# Altium project BlinkBoard_micro.PrjPcb (part 1 of 2)
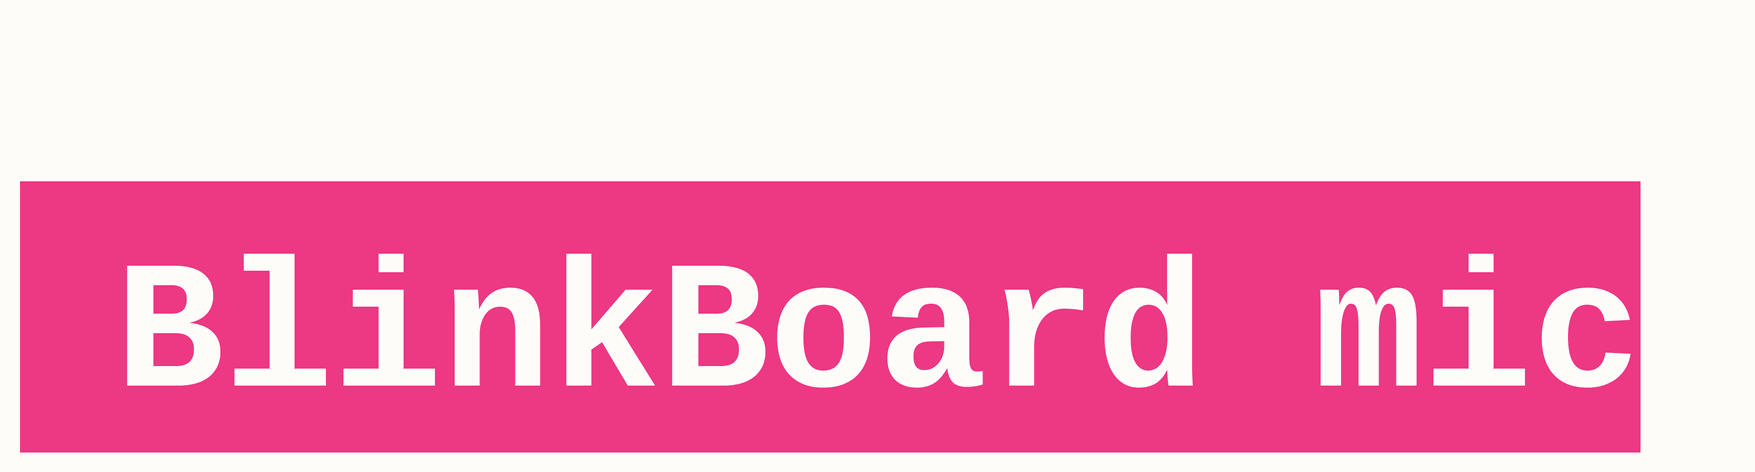
[diagram p0: Title.SchDoc]
3 sheets, 108 parts. Net scope: flat (ports and power ports of the same name join across sheets).
Board file: BlinkBoard_micro.PcbDoc
Sheets:
  Title.SchDoc
  BlinkBoard_micro_v1.SchDoc
  BlinkBoard_micro_v1_JACDAC.SchDoc

## Sheet Title.SchDoc
size A3; SheetNumber: 1; SheetTotal: 3

### Notes on the sheet
- BlinkBoard micro

## Sheet BlinkBoard_micro_v1.SchDoc: BlinkBoard
size A3; DrawnBy: Andrea; Revision: 0.1.0; SheetNumber: 2; SheetTotal: 3
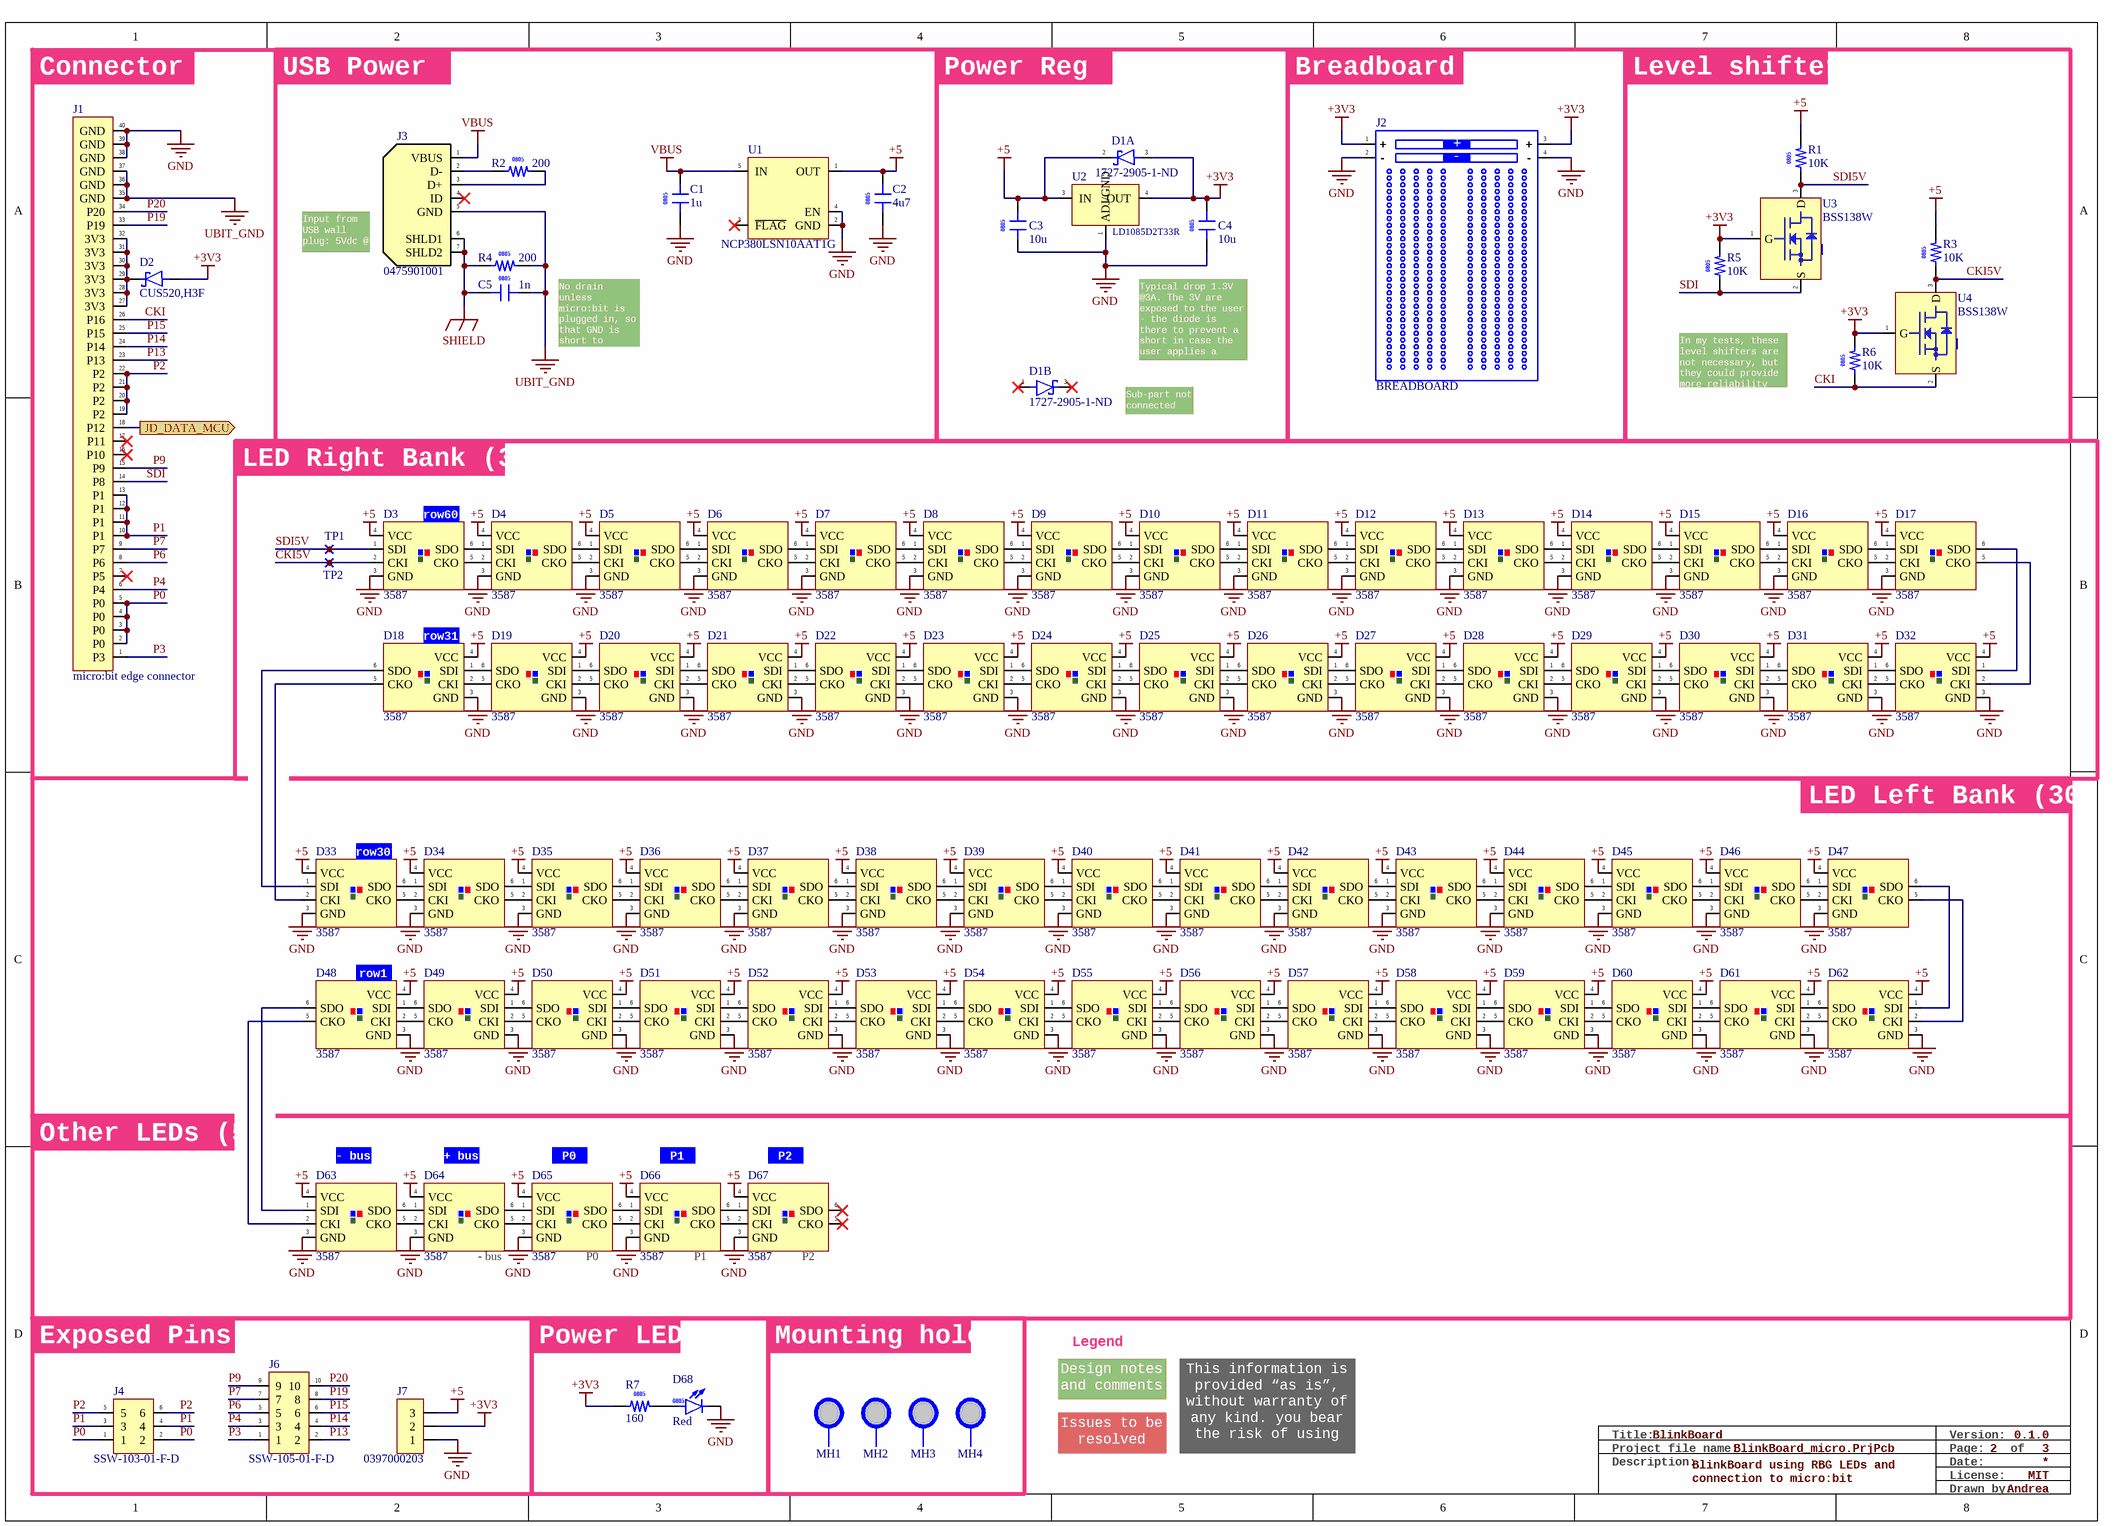
[diagram p1: BlinkBoard_micro_v1.SchDoc]

### Parts
C1  1u  [C0805]
C2  4u7  [C0805]
C3  10u  [C0805]
C4  10u  [C0805]
C5  1n  [C0805]
D1  1727-2905-1-ND  [SOT323]  (parts A,B of 2)
D2  CUS520,H3F  [FP-USC-MFG]
D3  3587  [APA102-2020]
D4  3587  [APA102-2020]
D5  3587  [APA102-2020]
D6  3587  [APA102-2020]
D7  3587  [APA102-2020]
D8  3587  [APA102-2020]
D9  3587  [APA102-2020]
D10  3587  [APA102-2020]
D11  3587  [APA102-2020]
D12  3587  [APA102-2020]
D13  3587  [APA102-2020]
D14  3587  [APA102-2020]
D15  3587  [APA102-2020]
D16  3587  [APA102-2020]
D17  3587  [APA102-2020]
D18  3587  [APA102-2020]
D19  3587  [APA102-2020]
D20  3587  [APA102-2020]
D21  3587  [APA102-2020]
D22  3587  [APA102-2020]
D23  3587  [APA102-2020]
D24  3587  [APA102-2020]
D25  3587  [APA102-2020]
D26  3587  [APA102-2020]
D27  3587  [APA102-2020]
D28  3587  [APA102-2020]
D29  3587  [APA102-2020]
D30  3587  [APA102-2020]
D31  3587  [APA102-2020]
D32  3587  [APA102-2020]
D33  3587  [APA102-2020]
D34  3587  [APA102-2020]
D35  3587  [APA102-2020]
D36  3587  [APA102-2020]
D37  3587  [APA102-2020]
D38  3587  [APA102-2020]
D39  3587  [APA102-2020]
D40  3587  [APA102-2020]
D41  3587  [APA102-2020]
D42  3587  [APA102-2020]
D43  3587  [APA102-2020]
D44  3587  [APA102-2020]
D45  3587  [APA102-2020]
D46  3587  [APA102-2020]
D47  3587  [APA102-2020]
D48  3587  [APA102-2020]
D49  3587  [APA102-2020]
D50  3587  [APA102-2020]
D51  3587  [APA102-2020]
D52  3587  [APA102-2020]
D53  3587  [APA102-2020]
D54  3587  [APA102-2020]
D55  3587  [APA102-2020]
D56  3587  [APA102-2020]
D57  3587  [APA102-2020]
D58  3587  [APA102-2020]
D59  3587  [APA102-2020]
D60  3587  [APA102-2020]
D61  3587  [APA102-2020]
D62  3587  [APA102-2020]
D63  3587  [APA102-2020]
D64  3587  [APA102-2020]
D65  3587  [APA102-2020]
D66  3587  [APA102-2020]
D67  3587  [APA102-2020]
D68  Red  [LED0805]
J1  micro:bit edge connector  [EDGE_CONNECTOR_40]
J2  BREADBOARD  [BREADBOARD]
J3  0475901001  [USB_MICRO]
J4  SSW-103-01-F-D  [HDR_6_2.54]
J6  SSW-105-01-F-D  [HDR_10_2.54]
J7  0397000203  [TERM_BLOCK_3POS]
MH1  MH 3.2mm NP  [MH3.2MM]  (value not drawn)  (no BOM)
MH2  MH 3.2mm NP  [MH3.2MM]  (value not drawn)  (no BOM)
MH3  MH 3.2mm NP  [MH3.2MM]  (value not drawn)  (no BOM)
MH4  MH 3.2mm NP  [MH3.2MM]  (value not drawn)  (no BOM)
R1  10K  [R0805]
R2  200  [R0805]
R3  10K  [R0805]
R4  200  [R0805]
R5  10K  [R0805]
R6  10K  [R0805]
R7  160  [R0805]
TP1  TEST  [TEST POINT]  (value not drawn)
TP2  TEST  [TEST POINT]  (value not drawn)
U1  NCP380LSN10AAT1G  [TSOP-5]
U2  LD1085D2T33R  [D2PAK]
U3  BSS138W  [SOT323]
U4  BSS138W  [SOT323]

### Blocks framed on the sheet
USB Power: C1 C2 C5 J3 R2 R4 U1
Power Reg: C3 C4 D1 U2
Breadboard: J2
Level shifters: R1 R3 R5 R6 U3 U4
LED Left Bank (30): D33-D62
Other LEDs (5): D63-D67
Exposed Pins: J4 J6 J7
Power LED: D68 R7
Mounting holes: MH1-MH4

### Ports
JD_DATA_MCU (out)

### Nets
+3V3: C4.2 D1.3 D2.2(A) J2.1(+) J2.3(+) J7.2 R5.2 R6.2 R7.1 U2.4(OUT) U3.1(G) U4.1(G)
+5: C2.2 C3.2 D1.2 D3.4(VCC) D4.4(VCC) D5.4(VCC) D6.4(VCC) D7.4(VCC) D8.4(VCC) D9.4(VCC) D10.4(VCC) D11.4(VCC) D12.4(VCC) D13.4(VCC) D14.4(VCC) D15.4(VCC) D16.4(VCC) D17.4(VCC) D18.4(VCC) D19.4(VCC) D20.4(VCC) D21.4(VCC) D22.4(VCC) D23.4(VCC) D24.4(VCC) D25.4(VCC) D26.4(VCC) D27.4(VCC) D28.4(VCC) D29.4(VCC) D30.4(VCC) D31.4(VCC) D32.4(VCC) D33.4(VCC) D34.4(VCC) D35.4(VCC) D36.4(VCC) D37.4(VCC) D38.4(VCC) D39.4(VCC) D40.4(VCC) D41.4(VCC) D42.4(VCC) D43.4(VCC) D44.4(VCC) D45.4(VCC) D46.4(VCC) D47.4(VCC) D48.4(VCC) D49.4(VCC) D50.4(VCC) D51.4(VCC) D52.4(VCC) D53.4(VCC) D54.4(VCC) D55.4(VCC) D56.4(VCC) D57.4(VCC) D58.4(VCC) D59.4(VCC) D60.4(VCC) D61.4(VCC) D62.4(VCC) D63.4(VCC) D64.4(VCC) D65.4(VCC) D66.4(VCC) D67.4(VCC) J7.3 R1.2 R3.2 U1.1(OUT) U2.3(IN)
GND: C1.1 C2.1 C3.1 C4.1 D3.3(GND) D4.3(GND) D5.3(GND) D6.3(GND) D7.3(GND) D8.3(GND) D9.3(GND) D10.3(GND) D11.3(GND) D12.3(GND) D13.3(GND) D14.3(GND) D15.3(GND) D16.3(GND) D17.3(GND) D18.3(GND) D19.3(GND) D20.3(GND) D21.3(GND) D22.3(GND) D23.3(GND) D24.3(GND) D25.3(GND) D26.3(GND) D27.3(GND) D28.3(GND) D29.3(GND) D30.3(GND) D31.3(GND) D32.3(GND) D33.3(GND) D34.3(GND) D35.3(GND) D36.3(GND) D37.3(GND) D38.3(GND) D39.3(GND) D40.3(GND) D41.3(GND) D42.3(GND) D43.3(GND) D44.3(GND) D45.3(GND) D46.3(GND) D47.3(GND) D48.3(GND) D49.3(GND) D50.3(GND) D51.3(GND) D52.3(GND) D53.3(GND) D54.3(GND) D55.3(GND) D56.3(GND) D57.3(GND) D58.3(GND) D59.3(GND) D60.3(GND) D61.3(GND) D62.3(GND) D63.3(GND) D64.3(GND) D65.3(GND) D66.3(GND) D67.3(GND) D68.1(C) J1.38(GND) J1.39(GND) J1.40(GND) J2.2(-) J2.4(-) J7.1 U1.2(GND) U1.4(EN) U2.1(ADJ/GND)
SHIELD: C5.1 J3.6(SHLD1) J3.7(SHLD2) R4.1
UBIT_GND: C5.2 J1.35(GND) J1.36(GND) J1.37(GND) J3.5(GND) R4.2
VBUS: C1.2 J3.1(VBUS) U1.5(IN)
CKI: J1.26(P16) R6.1 U4.2(S)
CKI5V: D3.2(CKI) R3.1 TP2.1 U4.3(D)
P0: J1.2(P0) J1.3(P0) J1.4(P0) J1.5(P0) J4.1 J4.2
P1: J1.10(P1) J1.11(P1) J1.12(P1) J1.13(P1) J4.3 J4.4
P2: J1.19(P2) J1.20(P2) J1.21(P2) J1.22(P2) J4.5 J4.6
P3: J1.1(P3) J6.1
P4: J1.6(P4) J6.3
P6: J1.8(P6) J6.5
P7: J1.9(P7) J6.7
P9: J1.15(P9) J6.9
P13: J1.23(P13) J6.2
P14: J1.24(P14) J6.4
P15: J1.25(P15) J6.6
P19: J1.33(P19) J6.8
P20: J1.34(P20) J6.10
SDI: J1.14(P8) R5.1 U3.2(S)
SDI5V: D3.1(SDI) R1.1 TP1.1 U3.3(D)
NetD2_1: D2.1(C) J1.27(3V3) J1.28(3V3) J1.29(3V3) J1.30(3V3) J1.31(3V3) J1.32(3V3)
NetD3_5: D3.5(CKO) D4.2(CKI)
NetD3_6: D3.6(SDO) D4.1(SDI)
NetD4_5: D4.5(CKO) D5.2(CKI)
NetD4_6: D4.6(SDO) D5.1(SDI)
NetD5_5: D5.5(CKO) D6.2(CKI)
NetD5_6: D5.6(SDO) D6.1(SDI)
NetD6_5: D6.5(CKO) D7.2(CKI)
NetD6_6: D6.6(SDO) D7.1(SDI)
NetD7_5: D7.5(CKO) D8.2(CKI)
NetD7_6: D7.6(SDO) D8.1(SDI)
NetD8_5: D8.5(CKO) D9.2(CKI)
NetD8_6: D8.6(SDO) D9.1(SDI)
NetD9_5: D9.5(CKO) D10.2(CKI)
NetD9_6: D9.6(SDO) D10.1(SDI)
NetD10_5: D10.5(CKO) D11.2(CKI)
NetD10_6: D10.6(SDO) D11.1(SDI)
NetD11_5: D11.5(CKO) D12.2(CKI)
NetD11_6: D11.6(SDO) D12.1(SDI)
NetD12_5: D12.5(CKO) D13.2(CKI)
NetD12_6: D12.6(SDO) D13.1(SDI)
NetD13_5: D13.5(CKO) D14.2(CKI)
NetD13_6: D13.6(SDO) D14.1(SDI)
NetD14_5: D14.5(CKO) D15.2(CKI)
NetD14_6: D14.6(SDO) D15.1(SDI)
NetD15_5: D15.5(CKO) D16.2(CKI)
NetD15_6: D15.6(SDO) D16.1(SDI)
NetD16_5: D16.5(CKO) D17.2(CKI)
NetD16_6: D16.6(SDO) D17.1(SDI)
NetD17_5: D17.5(CKO) D32.2(CKI)
NetD17_6: D17.6(SDO) D32.1(SDI)
NetD18_1: D18.1(SDI) D19.6(SDO)
NetD18_2: D18.2(CKI) D19.5(CKO)
NetD18_5: D18.5(CKO) D33.2(CKI)
NetD18_6: D18.6(SDO) D33.1(SDI)
NetD19_1: D19.1(SDI) D20.6(SDO)
NetD19_2: D19.2(CKI) D20.5(CKO)
NetD20_1: D20.1(SDI) D21.6(SDO)
NetD20_2: D20.2(CKI) D21.5(CKO)
NetD21_1: D21.1(SDI) D22.6(SDO)
NetD21_2: D21.2(CKI) D22.5(CKO)
NetD22_1: D22.1(SDI) D23.6(SDO)
NetD22_2: D22.2(CKI) D23.5(CKO)
NetD23_1: D23.1(SDI) D24.6(SDO)
NetD23_2: D23.2(CKI) D24.5(CKO)
NetD24_1: D24.1(SDI) D25.6(SDO)
NetD24_2: D24.2(CKI) D25.5(CKO)
NetD25_1: D25.1(SDI) D26.6(SDO)
NetD25_2: D25.2(CKI) D26.5(CKO)
NetD26_1: D26.1(SDI) D27.6(SDO)
NetD26_2: D26.2(CKI) D27.5(CKO)
NetD27_1: D27.1(SDI) D28.6(SDO)
NetD27_2: D27.2(CKI) D28.5(CKO)
NetD28_1: D28.1(SDI) D29.6(SDO)
NetD28_2: D28.2(CKI) D29.5(CKO)
NetD29_1: D29.1(SDI) D30.6(SDO)
NetD29_2: D29.2(CKI) D30.5(CKO)
NetD30_1: D30.1(SDI) D31.6(SDO)
NetD30_2: D30.2(CKI) D31.5(CKO)
NetD31_1: D31.1(SDI) D32.6(SDO)
NetD31_2: D31.2(CKI) D32.5(CKO)
NetD33_5: D33.5(CKO) D34.2(CKI)
NetD33_6: D33.6(SDO) D34.1(SDI)
NetD34_5: D34.5(CKO) D35.2(CKI)
NetD34_6: D34.6(SDO) D35.1(SDI)
NetD35_5: D35.5(CKO) D36.2(CKI)
NetD35_6: D35.6(SDO) D36.1(SDI)
NetD36_5: D36.5(CKO) D37.2(CKI)
NetD36_6: D36.6(SDO) D37.1(SDI)
NetD37_5: D37.5(CKO) D38.2(CKI)
NetD37_6: D37.6(SDO) D38.1(SDI)
NetD38_5: D38.5(CKO) D39.2(CKI)
NetD38_6: D38.6(SDO) D39.1(SDI)
NetD39_5: D39.5(CKO) D40.2(CKI)
NetD39_6: D39.6(SDO) D40.1(SDI)
NetD40_5: D40.5(CKO) D41.2(CKI)
NetD40_6: D40.6(SDO) D41.1(SDI)
NetD41_5: D41.5(CKO) D42.2(CKI)
NetD41_6: D41.6(SDO) D42.1(SDI)
NetD42_5: D42.5(CKO) D43.2(CKI)
NetD42_6: D42.6(SDO) D43.1(SDI)
NetD43_5: D43.5(CKO) D44.2(CKI)
NetD43_6: D43.6(SDO) D44.1(SDI)
NetD44_5: D44.5(CKO) D45.2(CKI)
NetD44_6: D44.6(SDO) D45.1(SDI)
NetD45_5: D45.5(CKO) D46.2(CKI)
NetD45_6: D45.6(SDO) D46.1(SDI)
NetD46_5: D46.5(CKO) D47.2(CKI)
NetD46_6: D46.6(SDO) D47.1(SDI)
NetD47_5: D47.5(CKO) D62.2(CKI)
NetD47_6: D47.6(SDO) D62.1(SDI)
NetD48_1: D48.1(SDI) D49.6(SDO)
NetD48_2: D48.2(CKI) D49.5(CKO)
NetD48_5: D48.5(CKO) D63.2(CKI)
NetD48_6: D48.6(SDO) D63.1(SDI)
NetD49_1: D49.1(SDI) D50.6(SDO)
NetD49_2: D49.2(CKI) D50.5(CKO)
NetD50_1: D50.1(SDI) D51.6(SDO)
NetD50_2: D50.2(CKI) D51.5(CKO)
NetD51_1: D51.1(SDI) D52.6(SDO)
NetD51_2: D51.2(CKI) D52.5(CKO)
NetD52_1: D52.1(SDI) D53.6(SDO)
NetD52_2: D52.2(CKI) D53.5(CKO)
NetD53_1: D53.1(SDI) D54.6(SDO)
NetD53_2: D53.2(CKI) D54.5(CKO)
NetD54_1: D54.1(SDI) D55.6(SDO)
NetD54_2: D54.2(CKI) D55.5(CKO)
NetD55_1: D55.1(SDI) D56.6(SDO)
NetD55_2: D55.2(CKI) D56.5(CKO)
NetD56_1: D56.1(SDI) D57.6(SDO)
NetD56_2: D56.2(CKI) D57.5(CKO)
NetD57_1: D57.1(SDI) D58.6(SDO)
NetD57_2: D57.2(CKI) D58.5(CKO)
NetD58_1: D58.1(SDI) D59.6(SDO)
NetD58_2: D58.2(CKI) D59.5(CKO)
NetD59_1: D59.1(SDI) D60.6(SDO)
NetD59_2: D59.2(CKI) D60.5(CKO)
NetD60_1: D60.1(SDI) D61.6(SDO)
NetD60_2: D60.2(CKI) D61.5(CKO)
NetD61_1: D61.1(SDI) D62.6(SDO)
NetD61_2: D61.2(CKI) D62.5(CKO)
NetD63_5: D63.5(CKO) D64.2(CKI)
NetD63_6: D63.6(SDO) D64.1(SDI)
NetD64_5: D64.5(CKO) D65.2(CKI)
NetD64_6: D64.6(SDO) D65.1(SDI)
NetD65_5: D65.5(CKO) D66.2(CKI)
NetD65_6: D65.6(SDO) D66.1(SDI)
NetD66_5: D66.5(CKO) D67.2(CKI)
NetD66_6: D66.6(SDO) D67.1(SDI)
NetD68_2: D68.2(A) R7.2
NetD72_3: J1.18(P12) ; port JD_DATA_MCU
NetJ3_2: J3.2(D-) R2.1
NetJ3_3: J3.3(D+) R2.2

Not connected (* = marked no-connect by the designer): D1 1*; D67 5(CKO)* 6(SDO)*; J1 7(P5)* 16(P10)* 17(P11)*; J3 4(ID)*; U1 3(~{FLAG})*

### Notes on the sheet
- (near J1) Connector
- Input from USB wall plug: 5Vdc @ 2.1A
- No drain unless micro:bit is plugged in, so that GND is short to UBIT_GND
- Typical drop 1.3V @3A. The 3V are exposed to the user - the diode is there to prevent a short in case the user applies a voltage higher than 3V.
- In my tests, these level shifters are not necessary, but they could provide more reliability
- LED Right Bank (30)
- Sub-part not connected
- (near D3) row60
- (near D18) row31
- (near D33) row30
- (near D48) row1
- (near D63) - bus
- (near D64) + bus
- (near D65) P0
- (near D66) P1
- (near D67) P2
- (near D64) - bus
- Legend
- Design notes and comments
- Issues to be resolved
- This information is provided “as is”, without warranty of any kind. you bear the risk of using it.
- Title:
- Description:
- Project file name:
- Drawn by:
- License:
- Page:
- Version:
- Date:
- of
- MIT
- BlinkBoard using RBG LEDs and connection to micro:bit
- (in symbol C0805_10u) 0805

### Library data of the parts
C1 = C0805_1u: Surface Mount Ceramic Multilayer Capacitor 1uF -20% to 80% Y5V 25V 0805 Paper T/R; Manufacturer: Yageo; Manufacturer Part Number: CC0805ZRY5V8BB105; Supplier 1: Digi-Key; RoHS: Yes; Category: Ceramic Capacitors; Stock 1: 285953; Mount: Surface Mount; Case/Package: 0805; Case Code (Metric): 2012; Case Code (Imperial): 0805; Weight: 0.000194oz; Min Operating Temperature: -30°C; Max Operating Temperature: 85°C; Capacitance: 1uF; Tolerance: 80%; Dielectric: Y5V; Package Quantity: 1; Voltage Rating: 25V; Packaging: Tape and Reel; Voltage Rating (DC): 25V; Termination: SMD/SMT; Resistor Type: Ceramic; Series: CC; Length: 2mm; Width: 0.049inch; Height: 0.85mm; Depth: 1.25mm; Thickness: 0.033inch; Radiation Hardening: No; RoHS Compliant: Yes; REACH SVHC: No SVHC; Lead Free: Lead Free; Halogen Free: Halogen Free; ComponentLink1URL: https://datasheet.ciiva.com/144/mlccorderingcode-144703.pdf?src-supplier=Digi-Key; ComponentLink1Description: https://datasheet.ciiva.com/144/mlccorderingcode-144703.pdf?src-supplier=Digi-Key; ComponentLink2URL: https://datasheet.ciiva.com/26863/getdatasheetpartid-419810-26863011.pdf?src-supplier=Verical; ComponentLink2Description: https://datasheet.ciiva.com/26863/getdatasheetpartid-419810-26863011.pdf?src-supplier=Verical; ComponentLink3URL: https://datasheet.ciiva.com/144/mlccorderingcode-144704.pdf?src-supplier=Digi-Key; ComponentLink3Description: https://datasheet.ciiva.com/144/mlccorderingcode-144704.pdf?src-supplier=Digi-Key; ComponentLink4URL: https://datasheet.ciiva.com/144/mlccorderingcode-144705.pdf?src-supplier=Digi-Key; ComponentLink4Description: https://datasheet.ciiva.com/144/mlccorderingcode-144705.pdf?src-supplier=Digi-Key; ComponentLink5URL: https://datasheet.ciiva.com/13208/upy-gp-np0-16v-to-50v-8-13208251.pdf?src-supplier=Mouser; ComponentLink5Description: https://datasheet.ciiva.com/13208/upy-gp-np0-16v-to-50v-8-13208251.pdf?src-supplier=Mouser; ComponentLink6URL: https://datasheet.ciiva.com/28450/1132289-28450860.pdf?src-supplier=Element14; ComponentLink6Description: https://datasheet.ciiva.com/28450/1132289-28450860.pdf?src-supplier=Element14; Supplier Part Number 1: 311-1358-1-ND; Pricing 1: 1=0.14000, 10=0.10200, 50=0.05820, 100=0.04820, 500=0.03378, 1000=0.02796 (USD)
C2 = C0805_4u7: Multilayer Ceramic Capacitors MLCC - SMD/SMT 4.7uF 6.3V X5R 10%; Manufacturer: Yageo; Manufacturer Part Number: CC0805KRX5R5BB475; Supplier 1: Digi-Key; RoHS: Yes; Category: Ceramic Capacitors; Stock 1: 19993; Mount: Surface Mount; Case/Package: 0805; Number of Pins: 2; Case Code (Imperial): 0805; Case Code (Metric): 2012; Weight: 0.000194oz; Min Operating Temperature: -55°C; Max Operating Temperature: 85°C; Capacitance: 4.7uF; Tolerance: 10%; Packaging: Tape and Reel; Voltage Rating (DC): 6.3V; Voltage Rating: 6.3V; Dielectric: X5R; Termination: SMD/SMT; Resistor Type: Ceramic; Series: CC; Length: 0.079inch; Width: 0.049inch; Thickness: 0.057inch; Lead Free: Lead Free; Halogen Free: Halogen Free; RoHS Compliant: Yes; ComponentLink1URL: http://www.mouser.com/ds/2/447/UPY-GPHC_X5R_4V-to-50V_25-1131599.pdf?src-supplier=Mouser; ComponentLink1Description: http://www.mouser.com/ds/2/447/UPY-GPHC_X5R_4V-to-50V_25-1131599.pdf?src-supplier=Mouser; ComponentLink2URL: http://components.arrow.com/part/dataview/0323_04166591?src-supplier=Arrow+Europe; ComponentLink2Description: http://components.arrow.com/part/dataview/0323_04166591?src-supplier=Arrow+Europe; ComponentLink3URL: http://www.yageo.com/documents/recent/UPY-GPHC_X5R_4V-to-50V_25.pdf?src-supplier=Digi-Key; ComponentLink3Description: http://www.yageo.com/documents/recent/UPY-GPHC_X5R_4V-to-50V_25.pdf?src-supplier=Digi-Key; ComponentLink4URL: http://www.yageo.com/documents/recent/UPY-GPHC_X5R_4V-to-50V_23.pdf?src-supplier=Digi-Key; ComponentLink4Description: http://www.yageo.com/documents/recent/UPY-GPHC_X5R_4V-to-50V_23.pdf?src-supplier=Digi-Key; Supplier Part Number 1: 311-3422-1-ND; Pricing 1: 1=0.17000, 10=0.12300, 50=0.07000, 100=0.05800, 500=0.04066, 1000=0.03365 (USD)
C3 C4 = C0805_10u: Cap Ceramic 10uF 10Vdc X5R 10% SMD 0805 85°C Paper T/R; Manufacturer: Yageo; Manufacturer Part Number: CC0805KPX5R6BB106; Supplier 1: Digi-Key; Stock 1: 54858; RoHS Compliant: Yes; ComponentLink1URL: http://datasheet.octopart.com/CC0805KPX5R6BB106-Yageo-datasheet-86397281.pdf; ComponentLink1Description: http://datasheet.octopart.com/CC0805KPX5R6BB106-Yageo-datasheet-86397281.pdf; Supplier Part Number 1: 13-CC0805KPX5R6BB106CT-ND; Pricing 1: 1=0.21000, 10=0.14300, 50=0.08560, 100=0.07240, 500=0.04952, 1000=0.04380, 2500=0.04190, 5000=0.03809 (USD)
C5 = C0805_1n: Surface Mount Ceramic Multilayer Capacitor 0.001uF 10% X7R 50V 0805 Paper T/R; Manufacturer: Yageo; Manufacturer Part Number: CC0805KRX7R9BB102; Capacitance: 1nF; Insulation Resistance: 100GR; Supplier 1: Digi-Key; RoHS: Yes; Category: Ceramic Capacitors; Stock 1: 240921; Mount: Surface Mount; Case/Package: 0805; Number of Pins: 2; Case Code (Metric): 2012; Case Code (Imperial): 0805; Material: Ceramic; Dielectric Material: Ceramic; Min Operating Temperature: -55°C; Max Operating Temperature: 125°C; Tolerance: 10%; Dielectric: X7R; Voltage Rating: 50V; Packaging: Tape and Reel; Voltage Rating (DC): 50V; Package Quantity: 1; Termination: SMD/SMT; Voltage: 50V; Series: CC; Length: 2mm; Width: 0.049inch; Height: 0.6mm; Depth: 1.25mm; Thickness: 0.024inch; Radiation Hardening: No; REACH SVHC: No SVHC; Lead Free: Lead Free; Halogen Free: Halogen Free; RoHS Compliant: Yes; ComponentLink1URL: https://datasheet.ciiva.com/11786/0900766b80d84f1d-11786074.pdf?src-supplier=RSComponents; ComponentLink1Description: https://datasheet.ciiva.com/11786/0900766b80d84f1d-11786074.pdf?src-supplier=RSComponents; ComponentLink2URL: https://datasheet.ciiva.com/144/mlccorderingcode-144616.pdf?src-supplier=Digi-Key; ComponentLink2Description: https://datasheet.ciiva.com/144/mlccorderingcode-144616.pdf?src-supplier=Digi-Key; ComponentLink3URL: https://datasheet.ciiva.com/144/mlccorderingcode-144617.pdf?src-supplier=Digi-Key; ComponentLink3Description: https://datasheet.ciiva.com/144/mlccorderingcode-144617.pdf?src-supplier=Digi-Key; ComponentLink4URL: https://datasheet.ciiva.com/144/mlccorderingcode-144618.pdf?src-supplier=Digi-Key; ComponentLink4Description: https://datasheet.ciiva.com/144/mlccorderingcode-144618.pdf?src-supplier=Digi-Key; ComponentLink5URL: https://datasheet.ciiva.com/16625/upy-gphc-x7r-6-3v-to-50v-8-16625547.pdf?src-supplier=Avnet+Europe; ComponentLink5Description: https://datasheet.ciiva.com/16625/upy-gphc-x7r-6-3v-to-50v-8-16625547.pdf?src-supplier=Avnet+Europe; ComponentLink6URL: https://datasheet.ciiva.com/46393/1489800-46393302.pdf?src-supplier=Element14; ComponentLink6Description: https://datasheet.ciiva.com/46393/1489800-46393302.pdf?src-supplier=Element14; ComponentLink7URL: https://datasheet.ciiva.com/28450/1489800-28450797.pdf?src-supplier=Element14; ComponentLink7Description: https://datasheet.ciiva.com/28450/1489800-28450797.pdf?src-supplier=Element14; Supplier Part Number 1: 311-1127-1-ND; Pricing 1: 1=0.10000, 10=0.07000, 50=0.03800, 100=0.03100, 500=0.02214, 1000=0.01739 (USD)
D1 = BAT54SW: Rectifier Diode Schottky 0.2A 5ns Automotive 3-Pin SC-70 T/R; Manufacturer: Nexperia; Manufacturer Part Number: BAT54SW,115; Supplier 1: Digi-Key; RoHS: Yes; Category: Rectifier Diodes; Stock 1: 166801; ComponentLink1URL: http://www.farnell.com/datasheets/1679676.pdf?src-supplier=Farnell; ComponentLink1Description: http://www.farnell.com/datasheets/1679676.pdf?src-supplier=Farnell; ComponentLink2URL: https://assets.nexperia.com/documents/data-sheet/BAT54W_SER.pdf?src-supplier=Digi-Key; ComponentLink2Description: https://assets.nexperia.com/documents/data-sheet/BAT54W_SER.pdf?src-supplier=Digi-Key; Supplier Part Number 1: 1727-2905-1-ND; Pricing 1: 1=0.23000, 10=0.20900, 100=0.11400, 500=0.07018, 1000=0.04785 (USD)
D2 = SCHOTTKY_0.2A: Diode Small Signal Schottky Si 0.2A 2-Pin USC T/R; Manufacturer: Toshiba; Average Rectified Current: 200mA; Max Repetitive Reverse Voltage (Vrrm): 30V; Element Configuration: Single; Max Reverse Current: 5uA; Peak Non-Repetitive Surge Current: 1A; Supplier 1: Digi-Key; Manufacturer Part Number: CUS520,H3F; RoHS: No; Category: Rectifier Diodes; Stock 1: 16652; Mount: Surface Mount; Number of Pins: 2; Contact Plating: Tin,Silver; Min Operating Temperature: -40°C; Max Operating Temperature: 100°C; Packaging: Tape and Reel; Max Reverse Voltage (DC): 30V; RoHS Compliant: No; ComponentLink1URL: https://toshiba.semicon-storage.com/info/docget.jsp?did=7041&prodName=CUS520&src-supplier=Digi-Key; ComponentLink1Description: https://toshiba.semicon-storage.com/info/docget.jsp?did=7041&prodName=CUS520&src-supplier=Digi-Key; ComponentLink2URL: http://toshiba.semicon-storage.com/info/docget.jsp?did=7041&prodName=CUS520&src-supplier=Avnet; ComponentLink2Description: http://toshiba.semicon-storage.com/info/docget.jsp?did=7041&prodName=CUS520&src-supplier=Avnet; ComponentLink3URL: http://toshiba.semicon-storage.com/info/lookup.jsp?pid=CUS520&amp;lang=en&src-supplier=Mouser; ComponentLink3Description: http://toshiba.semicon-storage.com/info/lookup.jsp?pid=CUS520&amp;lang=en&src-supplier=Mouser; Supplier Part Number 1: CUS520H3FCT-ND; Pricing 1: 1=0.22000, 10=0.17700, 100=0.09400, 500=0.06188, 1000=0.04208 (USD)
D3-D67 = DOT_STAR_LED: DotStar Micro LEDs (APA102–2020)- Smart SMD RGB LED - 100 pack; Manufacturer: Adafruit Industries; Color: Blue,Green,Red; Interface: Serial; Number of LEDs: 100; Supplier 1: Digi-Key; Manufacturer Part Number: 3587; RoHS: No; Stock 1: 113; Mount: Surface Mount; Length: 2mm; Width: 2mm; ComponentLink1URL: https://media.digikey.com/pdf/Data%20Sheets/Adafruit%20PDFs/3587_Web.pdf?src-supplier=Digi-Key; ComponentLink1Description: https://media.digikey.com/pdf/Data%20Sheets/Adafruit%20PDFs/3587_Web.pdf?src-supplier=Digi-Key; Supplier Part Number 1: 1528-2392-ND; Pricing 1: 1=29.95000 (USD)
D68 = LED0805: SMD LED red 2.4 V 0805, 150080RS75000, Würth Elektronik; Manufacturer: Wurth Electronics; Luminous Intensity: 150mcd; Viewing Angle: 140°; Forward Voltage: 2V; Wavelength: 625nm; Lens Style: Clear,Rectangular; Forward Current: 30mA; Test Current: 20mA; Supplier 1: Digi-Key; Manufacturer Part Number: 150080RS75000; RoHS: Yes; Category: LEDs; Stock 1: 53458; Mount: Surface Mount; Case/Package: 0805; Color: Red; Case Code (Metric): 2012; Case Code (Imperial): 0805; Min Operating Temperature: -40°C; Max Operating Temperature: 85°C; Package Quantity: 4000; Packaging: Tape and Reel; Dominant Wavelength: 625nm; Length: 2mm; Width: 1.25mm; Height: 0.7mm; REACH SVHC: Unknown; RoHS Compliant: Yes; ComponentLink1URL: https://datasheet.ciiva.com/22656/150080rs75000-22656961.pdf?src-supplier=Element14; ComponentLink1Description: https://datasheet.ciiva.com/22656/150080rs75000-22656961.pdf?src-supplier=Element14; ComponentLink2URL: https://datasheet.ciiva.com/29279/759435-da-01-en-chipled-0805-w-kl-rot-150080rs75000-29279032.pdf?src-supplier=Conrad; ComponentLink2Description: https://datasheet.ciiva.com/29279/759435-da-01-en-chipled-0805-w-kl-rot-150080rs75000-29279032.pdf?src-supplier=Conrad; Supplier Part Number 1: 732-4984-6-ND; Pricing 1: 1=0.18000, 50=0.16500, 100=0.14200, 500=0.12300 (USD)
J1 = EDGE_CONNECTOR_40: 3887 - SMT Right-Angle Connector for micro:bit; Manufacturer: Adafruit Industries; Manufacturer Part Number: 3887; Supplier 1: Digi-Key; RoHS: No; Stock 1: 1; Supplier Part Number 1: 1528-2644-ND; Pricing 1: 1=2.95000 (USD); ComponentLink1Description: Drawings; ComponentLink1URL: https://cdn-shop.adafruit.com/product-files/3887/3887_datasheet.pdf
J2 = BREADBOARD_60: Breadboard with 2 columns of 30 rows + VCC and GND rails
J3 = USB_MICRO: USB - micro AB  Receptacle Connector 5 Position Surface Mount, Right Angle, Horizontal; Manufacturer: Molex; Number of Terminals/Pins: 5; Number of Ports: 1; Max Voltage Rating (AC): 30V; Pitch: 0.65mm; Supplier 1: Digi-Key; Manufacturer Part Number: 0475901001; RoHS: Yes; Category: USB Connectors; Stock 1: 6607; Mount: Surface Mount,Horizontal; Contact Material: Copper Alloy; Housing Material: Thermoplastic; Min Operating Temperature: -30°C; Max Operating Temperature: 85°C; Packaging: Tape and Reel; Package Quantity: 1500; Connector Type: USB; Number of Contacts: 5; Gender: Receptacle; Termination: Solder; Orientation: Right Angle; Features: Shielded; Length: 8.65mm; Depth: 6.1mm; Radiation Hardening: No; RoHS Compliant: Yes; ComponentLink1URL: https://datasheet.ciiva.com/29660/475901001-sd-29660111.pdf?src-supplier=Digi-Key; ComponentLink1Description: https://datasheet.ciiva.com/29660/475901001-sd-29660111.pdf?src-supplier=Digi-Key; Supplier Part Number 1: WM14336CT-ND; Pricing 1: 1=0.97000, 10=0.79900, 100=0.66600 (USD)
J4 = HDR_6_2.54: SAMTEC - SSW-103-01-F-D - CONNECTOR, RECEPTACLE, 6 CONTACTS, 2 ROWS, 2.54 MM; Max Current Rating: 7.6A; Contact Resistance: 10mR; Max Voltage Rating (AC): 550V; Number of Contacts: 6; Gender: Female; Mating Cycles: 100; Pitch: 2.54mm; Supplier 1: Digi-Key; Manufacturer: Samtec; Manufacturer Part Number: SSW-103-01-F-D; RoHS: Yes; Category: Headers and Wire Housings; Stock 1: 1509; Contact Plating: Gold; Contact Material: Bronze; Housing Color: Black; Color: Black; Housing Material: Polymer; Min Operating Temperature: -55°C; Max Operating Temperature: 125°C; Number of Rows: 2; Packaging: Bulk; Termination: Solder; Orientation: Vertical; Length: 8.13mm; Depth: 4.95mm; Radiation Hardening: No; RoHS Compliant: Yes; ComponentLink1URL: http://www.farnell.com/datasheets/2550265.pdf?src-supplier=Farnell; ComponentLink1Description: http://www.farnell.com/datasheets/2550265.pdf?src-supplier=Farnell; ComponentLink2URL: http://components.arrow.com/part/dataview/4842126S6546715N1004?src-supplier=Arrow+Electronics; ComponentLink2Description: http://components.arrow.com/part/dataview/4842126S6546715N1004?src-supplier=Arrow+Electronics; ComponentLink3URL: http://components.arrow.com/part/dataview/0323_00788229?src-supplier=Arrow+Europe; ComponentLink3Description: http://components.arrow.com/part/dataview/0323_00788229?src-supplier=Arrow+Europe; ComponentLink4URL: ftp://ftp.samtec.com/webfiles/PDF/SSQ_TH.PDF?src-supplier=Avnet; ComponentLink4Description: ftp://ftp.samtec.com/webfiles/PDF/SSQ_TH.PDF?src-supplier=Avnet; ComponentLink5URL: http://suddendocs.samtec.com/catalog_english/ssw_th.pdf?src-supplier=Digi-Key; ComponentLink5Description: http://suddendocs.samtec.com/catalog_english/ssw_th.pdf?src-supplier=Digi-Key; ComponentLink6URL: ftp://ftp.samtec.com/webfiles/PDF/SSQ_TH.PDF?src-supplier=Avnet+Europe; ComponentLink6Description: ftp://ftp.samtec.com/webfiles/PDF/SSQ_TH.PDF?src-supplier=Avnet+Europe; ComponentLink7URL: http://www.farnell.com/datasheets/2550265.pdf?src-supplier=Newark; ComponentLink7Description: http://www.farnell.com/datasheets/2550265.pdf?src-supplier=Newark; Supplier Part Number 1: SAM10016-ND; Pricing 1: 1=1.42000, 10=1.28700, 100=1.10290, 500=0.91910, 1000=0.78780, 5000=0.69852, 10000=0.68276 (USD)
J6 = HDR_10_2.54: Conn Socket Strip SKT 10 POS 2.54mm Solder ST Thru-Hole; Manufacturer: Samtec; Max Current Rating: 6.9A; Contact Resistance: 10mR; Max Voltage Rating (AC): 550V; Number of Contacts: 10; Gender: Female; Mating Cycles: 100; Supplier 1: Digi-Key; Manufacturer Part Number: SSW-105-01-F-D; RoHS: Yes; Category: Headers and Wire Housings; Stock 1: 1336; Contact Plating: Gold; Contact Material: Bronze; Housing Color: Black; Color: Black; Housing Material: Polymer; Min Operating Temperature: -55°C; Max Operating Temperature: 125°C; Number of Rows: 2; Packaging: Bulk; Termination: Solder; Orientation: Straight; Length: 13.21mm; Pitch: 2.54mm; Depth: 4.95mm; Radiation Hardening: No; ComponentLink1URL: http://components.arrow.com/part/dataview/2696898S8147588N1004?src-supplier=Arrow+Electronics; ComponentLink1Description: http://components.arrow.com/part/dataview/2696898S8147588N1004?src-supplier=Arrow+Electronics; ComponentLink2URL: http://components.arrow.com/part/dataview/0323_01330192?src-supplier=Arrow+Europe; ComponentLink2Description: http://components.arrow.com/part/dataview/0323_01330192?src-supplier=Arrow+Europe; ComponentLink3URL: http://suddendocs.samtec.com/catalog_english/ssw_th.pdf?src-supplier=Digi-Key; ComponentLink3Description: http://suddendocs.samtec.com/catalog_english/ssw_th.pdf?src-supplier=Digi-Key; ComponentLink4URL: ftp://ftp.samtec.com/webfiles/PDF/SSQ_TH.PDF?src-supplier=Avnet; ComponentLink4Description: ftp://ftp.samtec.com/webfiles/PDF/SSQ_TH.PDF?src-supplier=Avnet; ComponentLink5URL: ftp://ftp.samtec.com/webfiles/PDF/SSQ_TH.PDF?src-supplier=Avnet+Europe; ComponentLink5Description: ftp://ftp.samtec.com/webfiles/PDF/SSQ_TH.PDF?src-supplier=Avnet+Europe; Supplier Part Number 1: SAM9143-ND; Pricing 1: 1=1.87000, 10=1.62900, 100=1.45530, 500=1.21276, 1000=1.03950, 5000=0.92400 (USD)
J7 = TERM_BLOCK_3POS: SPRING TERMINAL BLOCK 3CVERT GRE; Manufacturer: Molex; Plating: Steel; Number of Levels: 1; Number of Positions Per Level: 3; Current: 6A; Voltage: 150V; Pitch: 0.1inch; Wire Gauge (Max): 26AWG; Wire Gauge (Min): 18AWG; Supplier 1: Digi-Key; Manufacturer Part Number: 0397000203; RoHS: Yes; Category: Terminal Blocks; Stock 1: 1368; Mount: Through Hole; Color: Green; Contact Plating: Brass,Tin; Housing Material: Nylon; Min Operating Temperature: -40°C; Max Operating Temperature: 105°C; Packaging: Bulk; Termination: Screwless; RoHS Compliant: Yes; ComponentLink1URL: http://www.molex.com/pdm_docs/sd/397000202_sd.pdf?src-supplier=Digi-Key; ComponentLink1Description: http://www.molex.com/pdm_docs/sd/397000202_sd.pdf?src-supplier=Digi-Key; Supplier Part Number 1: WM22175-ND; Pricing 1: 1=1.71000, 10=1.29200, 25=1.19680, 50=1.07620, 100=1.05000, 250=0.91876, 500=0.84000, 1000=0.76125, 5000=0.70000 (USD)
MH1-MH4 = MHNP: Mounting hole 3.2mm non plated
R1 R3 R5 R6 = R0805_10K: Res Thick Film 0805 10K Ohm 5% 1/8W ±100ppm/°C Molded SMD Paper T/R; Manufacturer: Yageo; Manufacturer Part Number: RC0805JR-0710KL; Resistance: 10kR; Power Rating: 125mW; Voltage Rating: 150V; Supplier 1: Digi-Key; RoHS: Yes; Category: Chip SMD Resistors; Stock 1: 3609276; Case/Package: 0805; Case Code (Imperial): 0805; Case Code (Metric): 2012; Contact Plating: Tin,Matte; Size Code: 0805; Min Operating Temperature: -55°C; Max Operating Temperature: 155°C; Tolerance: 5%; Packaging: Tape and Reel; Termination: SMD/SMT; Resistor Type: Thick Film; Temperature Coefficient: 100ppm/°C; Features: Moisture Resistant; Series: RC; Max Power Dissipation: 125mW; Number of Terminations: 2; Resistance Tolerance: 5%; Construction: Rectangular; Length: 2mm; Width: 1.25mm; Height: 0.5mm; Depth: 1.25mm; Radiation Hardening: No; REACH SVHC: Unknown; Military Standard: Not; Lead Free: Lead Free; RoHS Compliant: Yes; ComponentLink1URL: https://datasheet.ciiva.com/7941/444164-7941870.pdf?src-supplier=Element14; ComponentLink1Description: https://datasheet.ciiva.com/7941/444164-7941870.pdf?src-supplier=Element14; ComponentLink2URL: https://datasheet.ciiva.com/7941/444164-7941871.pdf?src-supplier=Element14; ComponentLink2Description: https://datasheet.ciiva.com/7941/444164-7941871.pdf?src-supplier=Element14; ComponentLink3URL: https://datasheet.ciiva.com/7983/444164-7983765.pdf?src-supplier=Element14; ComponentLink3Description: https://datasheet.ciiva.com/7983/444164-7983765.pdf?src-supplier=Element14; Supplier Part Number 1: 311-10KARCT-ND; Pricing 1: 1=0.10000, 10=0.03600, 100=0.01450, 1000=0.00652, 2500=0.00566 (USD)
R2 R4 = R0805_200: RES SMD 200 OHM 0.5% 1/8W 0805; Manufacturer: Yageo; Manufacturer Part Number: RT0805DRE07200RL; Resistance: 200R; Max Power Dissipation: 125mW; Temperature Coefficient: 50ppm/°C; Voltage Rating (DC): 150V; Supplier 1: Digi-Key; RoHS: Yes; Category: Chip SMD Resistors; Stock 1: 730; Case/Package: 0805; Case Code (Metric): 2012; Case Code (Imperial): 0805; Min Operating Temperature: -55°C; Max Operating Temperature: 155°C; Package Quantity: 5000; Packaging: Tape and Reel; Tolerance: 0.5%; Resistor Type: Thin Film; Number of Terminations: 2; Features: Moisture Resistant; Series: RT; Length: 0.079inch; Width: 0.049inch; Height: 0.024inch; Lead Free: Lead Free; RoHS Compliant: Yes; ComponentLink1URL: https://datasheet.ciiva.com/2569/pyu-rt-1-to-0-05-rohs-l-5-2569311.pdf?src-supplier=Digi-Key; ComponentLink1Description: https://datasheet.ciiva.com/2569/pyu-rt-1-to-0-05-rohs-l-5-2569311.pdf?src-supplier=Digi-Key; Supplier Part Number 1: 311-2816-1-ND; Pricing 1: 1=0.12000, 10=0.11000, 100=0.04220, 1000=0.01855, 2500=0.01602 (USD)
R7 = R0805_160: RES SMD 160 OHM 5% 1/8W 0805; Manufacturer: Yageo; Manufacturer Part Number: RC0805JR-07160RL; Power Rating: 125mW; Resistance: 160R; Voltage Rating: 150V; Temperature Coefficient: 100ppm/°C; Supplier 1: Digi-Key; RoHS: Yes; Category: Chip SMD Resistors; Stock 1: 42846; Case/Package: 0805; Case Code (Imperial): 0805; Case Code (Metric): 2012; Contact Plating: Tin,Matte; Min Operating Temperature: -55°C; Max Operating Temperature: 155°C; Packaging: Tape and Reel; Tolerance: 5%; Package Quantity: 1; Termination: SMD/SMT; Resistor Type: Thick Film; Number of Terminations: 2; Max Power Dissipation: 125mW; Voltage Rating (DC): 150V; Features: Moisture Resistant; Series: RC; Construction: Rectangular; Length: 2mm; Width: 1.25mm; Height: 0.024inch; Depth: 1.25mm; Radiation Hardening: No; Military Standard: Not; Lead Free: Lead Free; RoHS Compliant: Yes; ComponentLink1URL: https://datasheet.ciiva.com/2456/pyu-r-int-thick-7-2456164.pdf?src-supplier=Digi-Key; ComponentLink1Description: https://datasheet.ciiva.com/2456/pyu-r-int-thick-7-2456164.pdf?src-supplier=Digi-Key; ComponentLink2URL: https://datasheet.ciiva.com/2456/pyu-r-int-thick-7-2456165.pdf?src-supplier=Digi-Key; ComponentLink2Description: https://datasheet.ciiva.com/2456/pyu-r-int-thick-7-2456165.pdf?src-supplier=Digi-Key; ComponentLink3URL: https://datasheet.ciiva.com/2456/pyu-r-int-thick-7-2456166.pdf?src-supplier=Digi-Key; ComponentLink3Description: https://datasheet.ciiva.com/2456/pyu-r-int-thick-7-2456166.pdf?src-supplier=Digi-Key; Supplier Part Number 1: 311-160ARCT-ND; Pricing 1: 1=0.10000, 10=0.03600, 100=0.01450, 1000=0.00652, 2500=0.00566 (USD)
TP1 TP2 = TEST: Test point
U1 = NCP380: REEL / OVER CURRENT PROTECTION; Manufacturer: ON Semiconductor; Number of Outputs: 1; Max Input Voltage: 5.5V; Min Input Voltage: 2.5V; Max Power Dissipation: 325mW; Number of Inputs: 2; Current Rating: 1A; Interface: On/Off; On-State Resistance: 135mR; Turn-On Delay Time: 4ms; Turn-Off Delay Time: 3ms; Output Configuration: High Side; On-state Resistance-Max: 110MR; Supplier 1: Digi-Key; Manufacturer Part Number: NCP380LSN10AAT1G; RoHS: Yes; Category: USB Interface ICs; Mount: Surface Mount; Case/Package: TSOP; Number of Pins: 5; Min Operating Temperature: -40°C; Max Operating Temperature: 85°C; Package Quantity: 1; Packaging: Tape and Reel; Output Current: 1A; Max Output Current: 1A; Operating Supply Voltage: 5.5V; Series: -; Number of Switches: 1; Rated Current-Max: 1A; Length: 3mm; Width: 1.5mm; Height: 1mm; Lead Free: Lead Free; Halogen Free: Halogen Free; RoHS Compliant: Yes; ComponentLink1URL: https://datasheet.ciiva.com/1939/ncp380-d-1939778.pdf?src-supplier=Digi-Key; ComponentLink1Description: https://datasheet.ciiva.com/1939/ncp380-d-1939778.pdf?src-supplier=Digi-Key; ComponentLink2URL: https://datasheet.ciiva.com/1939/ncp380-d-1939779.pdf?src-supplier=Digi-Key; ComponentLink2Description: https://datasheet.ciiva.com/1939/ncp380-d-1939779.pdf?src-supplier=Digi-Key; ComponentLink3URL: https://datasheet.ciiva.com/1939/ncp380-d-1939780.pdf?src-supplier=Digi-Key; ComponentLink3Description: https://datasheet.ciiva.com/1939/ncp380-d-1939780.pdf?src-supplier=Digi-Key; ComponentLink4URL: https://datasheet.ciiva.com/16468/ncp380-d-16468713.pdf?src-supplier=Future+Electronics; ComponentLink4Description: https://datasheet.ciiva.com/16468/ncp380-d-16468713.pdf?src-supplier=Future+Electronics; Supplier Part Number 1: NCP380LSN10AAT1GOSCT-ND; Pricing 1: 1=0.76000, 10=0.66500, 25=0.62440, 100=0.50950, 250=0.47328, 500=0.40280, 1000=0.33250 (USD); Supplier 2: Digi-Key
U2 = LD1085D2T33R: Fixed LDO Voltage Regulator, 6.3V to 30V, 1.3V Dropout, 3.3Vout, 3Aout, TO-263-3; Manufacturer: STMicroelectronics; Number of Outputs: 1; Max Output Current: 3A; Output Voltage: 3.3V; Min Supply Voltage: 4.9V; Input Bias Current: 5mA; Polarity: Positive; Quiescent Current: 10mA; Max Output Voltage: 3.333V; Accuracy: 1%; Supplier 1: Digi-Key; Manufacturer Part Number: LD1085D2T33R; Stock 1: 5416; Mount: Surface Mount; Case/Package: TO-263; Number of Pins: 3; Weight: 0.01lb; Contact Plating: Tin,Matte; Min Operating Temperature: -40°C; Max Operating Temperature: 125°C; Packaging: Tape and Reel; Max Input Voltage: 30V; Dropout Voltage: 1.3V; Output Current: 3A; Max Supply Voltage: 30V; Package Quantity: 1; Min Input Voltage: 6.3V; Nominal Output Voltage: 3.3V; Number of Regulators: 1; Min Output Voltage: 3.3V; Termination: SMD/SMT; Output Voltage Accuracy: 1%; Length: 10.4mm; Height: 4.6mm; Width: 9.35mm; Radiation Hardening: No; REACH SVHC: No SVHC; Lead Free: Lead Free; ComponentLink1URL: https://datasheet.ciiva.com/16375/cd00001883-16375381.pdf; ComponentLink1Description: https://datasheet.ciiva.com/16375/cd00001883-16375381.pdf; ComponentLink2URL: https://datasheet.ciiva.com/1511/1761309-1511542.pdf; ComponentLink2Description: https://datasheet.ciiva.com/1511/1761309-1511542.pdf; ComponentLink3URL: https://datasheet.ciiva.com/22694/1761309-22694841.pdf; ComponentLink3Description: https://datasheet.ciiva.com/22694/1761309-22694841.pdf; ComponentLink4URL: https://datasheet.ciiva.com/2044/cd00001883-2044187.pdf; ComponentLink4Description: https://datasheet.ciiva.com/2044/cd00001883-2044187.pdf; ComponentLink5URL: https://datasheet.ciiva.com/15111/getdatasheetpartid-65476-15111291.pdf; ComponentLink5Description: https://datasheet.ciiva.com/15111/getdatasheetpartid-65476-15111291.pdf; ComponentLink6URL: https://datasheet.ciiva.com/2044/cd00001883-2044188.pdf; ComponentLink6Description: https://datasheet.ciiva.com/2044/cd00001883-2044188.pdf; ComponentLink7URL: https://datasheet.ciiva.com/2044/cd00001883-2044189.pdf; ComponentLink7Description: https://datasheet.ciiva.com/2044/cd00001883-2044189.pdf; ComponentLink8URL: https://datasheet.ciiva.com/41439/001184676-da-01-en-ic-reg-ldo-3-3-ld1085d2t33r-to-263-3-stm-41439834.pdf; ComponentLink8Description: https://datasheet.ciiva.com/41439/001184676-da-01-en-ic-reg-ldo-3-3-ld1085d2t33r-to-263-3-stm-41439834.pdf; Supplier Part Number 1: 497-1222-6-ND; Pricing 1: 1=1.46, 10=1.305, 100=1.0176, 500=0.84066 (USD)
U3 U4 = BSS138W: MOSFET 50V N-CH Logic Level; Manufacturer: Fairchild Semiconductor; Channel Type: N-Channel; Drain-Source On Resistance-Max: 3.5 O; Qg Gate Charge: 1.1 nC; Rated Power Dissipation: 340 mW; Supplier 1: Digi-Key; Manufacturer Part Number: BSS138W; Stock 1: 55420; Drain-to-Source Voltage [Vdss]: 50 V; ComponentLink1URL: https://datasheet.ciiva.com/17170/bss138w-17170739.pdf; ComponentLink1Description: https://datasheet.ciiva.com/17170/bss138w-17170739.pdf; ComponentLink2URL: https://datasheet.ciiva.com/8115/bss138w-8115367.pdf; ComponentLink2Description: https://datasheet.ciiva.com/8115/bss138w-8115367.pdf; ComponentLink3URL: https://datasheet.ciiva.com/15043/bss138w-15043927.pdf; ComponentLink3Description: https://datasheet.ciiva.com/15043/bss138w-15043927.pdf; ComponentLink4URL: https://datasheet.ciiva.com/15043/bss138w-15043928.pdf; ComponentLink4Description: https://datasheet.ciiva.com/15043/bss138w-15043928.pdf; ComponentLink5URL: https://datasheet.ciiva.com/15043/bss138w-15043929.pdf; ComponentLink5Description: https://datasheet.ciiva.com/15043/bss138w-15043929.pdf; ComponentLink6URL: https://datasheet.ciiva.com/8115/bss138w-8115370.pdf; ComponentLink6Description: https://datasheet.ciiva.com/8115/bss138w-8115370.pdf; ComponentLink7URL: https://datasheet.ciiva.com/26146/bss138w-26146843.pdf; ComponentLink7Description: https://datasheet.ciiva.com/26146/bss138w-26146843.pdf; ComponentLink8URL: https://datasheet.ciiva.com/13042/bss138w-91619-13042909.pdf; ComponentLink8Description: https://datasheet.ciiva.com/13042/bss138w-91619-13042909.pdf; Supplier Part Number 1: BSS138WCT-ND